# Altium schematic sheet JWB-001_Charger.SchDoc: Charger Design
size B; CompanyName: Rigado, LLC; Organization: Rigado; SheetNumber: 1; Website: www.rigado.com; SheetSize: B
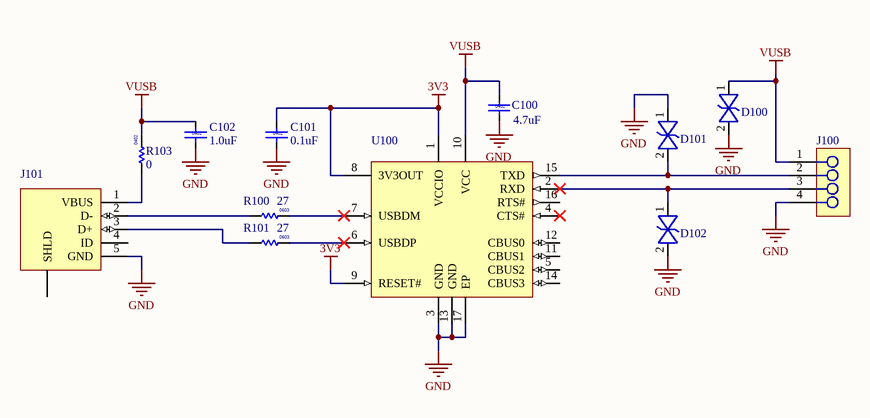
[diagram p0: JWB-001_Charger.SchDoc]

## Parts
(Parts that share a designator on the sheet are numbered #1, #2 ... from top to bottom, then left to right.)
?#1  (no value)  (graphical)
?#2  (no value)  (graphical)
C100  value 4.7uF  Size: 0402  [Cap 0402 HD]  (hidden comment: Cap 0402 4.7uF 10V4.7uF)
C101  value 0.1uF  Size: 0402  [Cap 0402 HD]  (hidden comment: Cap 0402 0.1uF 10V0.1uF)
C102  value 1.0uF  Size: 0402  [Cap 0402 HD]  (hidden comment: Cap 0402 1.0uF 10V1.0uF)
D100  SESD0402P1BN-0450-0906V  [CAP 0402 HD]  (value not drawn)
D101  SESD0402P1BN-0450-0906V  [CAP 0402 HD]  (value not drawn)
D102  SESD0402P1BN-0450-0906V  [CAP 0402 HD]  (value not drawn)
J100  854-22-004-30-001101  [HDR.050P-4Pin-SMT-R]  (value not drawn)
J101  USB_Micro_B_W-Tabs  [USB_Micro_RA_W-TABS]  (value not drawn)
R100  value 27  Size: 0603  [RES 0603 HD]  (hidden comment: Res 0603 27R 5%27)
R101  value 27  Size: 0603  [RES 0603 HD]  (hidden comment: Res 0603 27R 5%27)
R103  value 0  Size: 0402  [RES 0402]  (hidden comment: Res 0402 0R Jumper0)
U100  FT230XQ  [QFN0.65P4x4-16Pin_W-Pad]  (value not drawn)

## Nets
3V3: C101.1 U100.1(VCCIO) U100.8(3V3OUT) U100.9(RESET#)
GND: C100.2 C101.2 C102.2 D100.2 D101.1 D102.2 J100.4 J101.5(GND) U100.3(GND) U100.13(GND) U100.17(EP)
VUSB: C100.1 C102.1 D100.1 J100.1 R103.2 U100.10(VCC)
NetD101_2: D101.2 J100.2 U100.15(TXD)
NetD102_1: D102.1 J100.3 U100.2(RXD)
NetJ101_1: J101.1(VBUS) R103.1
NetJ101_2: J101.2(D-) R100.1
NetJ101_3: J101.3(D+) R101.1
NetR100_2: R100.2 U100.7(USBDM)
NetR101_2: R101.2 U100.6(USBDP)

Not connected (* = marked no-connect by the designer): J101 4(ID) 6(SHLD); U100 4(CTS#)* 5(CBUS2) 11(CBUS1) 12(CBUS0) 14(CBUS3) 16(RTS#)

## Notes on the sheet
- Rev.
- Description
- Revision
- Date
- By
- Prepared By
- Revision:
- Page:

## Library data of the parts
?#1 = Top_Revision_Block: Release Revision History Block
?#2 = Top_Title_Block: Top level schematic title block for top level sheet
C100 = Cap 0402 4.7uF 10V: Cap, Ceramic 4.7uF 10V 20% X5R 0402; Manufacturer P/N: CL05A475MP5NRNC; Manufacturer: Samsung; Manufacturer 2 P/N: C1005X5R1A475M050BC; Vendor: Digikey; Vendor P/N: 1276-1482-1-ND; Added By: Jeremy D; Part Number: Cap 0402 4.7uF 10V; Tolerance: 20%; Voltage: 10V; Manufacturer 2: TDK; Temp Coefficient: X5R; Height: 0.55m; Added Date: 2/1/2015; Checked By: Paul B; Checked Date: 2/5/2015
C101 = Cap 0402 0.1uF 10V: Cap, Ceramic 0.1uF 10V 10% X5R 0402; Manufacturer P/N: GRM155R61A104KA01J; Manufacturer: Murata; Manufacturer 2 P/N: CC0402KRX5R6BB104; Added By: Jeremy D; Part Number: Cap 0402 0.1uF 10V; Tolerance: 10%; Voltage: 10V; Manufacturer 2: Yageo; Temp Coefficient: X5R; Height: 0.6mm; Supplier 1: Digi-key; Supplier Part Number 1: 490-6297-1-ND; Added Date: 4/7/2015; Checked By: Joe K; Checked Date: 4/10/2015
C102 = Cap 0402 1.0uF 10V: Cap, Ceramic 1.0uF 10V 10% X5R 0402; Manufacturer P/N: GRM155R61A105KE15D; Manufacturer: Murata; Manufacturer 2 P/N: C1005X5R0J105K050BB; Added By: Jeremy D; Part Number: Cap 0402 1.0uF 10V; Tolerance: 10%; Voltage: 10V; Manufacturer 2: TDK; Temp Coefficient: X5R; Height: 0.55mm; Supplier 1: Digi-key; Supplier Part Number 1: 490-3890-1-ND; Added Date: 2/1/2015; Checked By: Paul B; Checked Date: 2/5/2015
D100-D102 = SESD0402P1BN-0450-090: ESD TVS Diode, 16kV air, 0402; Manufacturer: TE Connectivity; Voltage Rated: 6V; Vendor: Digikey; Vendor P/N: SESD0402P1BN-0450-090CT-ND; Added By: Jeremy D; Part Number: SESD0402P1BN-0450-090; Manufacturer P/N: SESD0402P1BN-0450-090; Size: 1.1mm x 0.5mm; Package: 0402; Height: 0.6mm; Type: TVS; Added Date: 2/1/2015; Checked By: Paul B; Checked Date: 2/5/2015
J100 = 854-22-004-30-001101: Spring Loaded Header 0.05" Pitch, 4Pin, 4x1, 4.98mm - 6.4mm Height; Manufacturer: Mill-Max; Contacts: 4; Rows: 1; Locking: No; Vendor: Mouser; Vendor P/N: 575-854-22-004-30; Added By: Jeremy D; Part Number: 854-22-004-30-001101; Manufacturer P/N: 854-22-004-30-001101; Size: 5.47mm x 2.21mm; Height: 6.4mm; Pin Pitch: 0.05"; Keyed: No; Added Date: 2/23/2015; Checked By: Cam N; Checked Date: 2/27/2015
J101 = USB_Micro_B_W-Tabs: USB Micro B Receptacle, Right Angle, SMT with 4 TH Tabs; Manufacturer: FCI; Manufacturer P/N: 10118194-0001LF; Manufacturer 2 P/N: ZX62D-B-5P8; Contacts: 6; Rows: 1; Pin Pitch: 0.65mm; Locking: No; Keyed: Yes; Vendor: Digikey; Vendor P/N: 609-4618-1-ND; Added By: Jeremy D; Part Number: USB_Micro_B_W-Tabs; Manufacturer 2: Hirose; Size: 8mm x 5mm; Height: 2.8mm; Added Date: 3/5/2015
R100 R101 = Res 0603 27R 5%: Resistor 27 ohm 5%, 1/10W, 0603; Manufacturer P/N: MCR03ERTJ270; Manufacturer: Rohm; Manufacturer 2 P/N: RC1608J270CS; Vendor: Digikey; Vendor P/N: RHM27CGCT-ND; Added By: Jeremy D; Part Number: Res 0603 27R 5%; Manufacturer 2: Samsung; Tolerance: 5%; Height: .55mm; Power: 1/10W; Added Date: 3/5/2015
R103 = Res 0402 0R Jumper: Resistor 0 ohm 1/16W 0402; Manufacturer P/N: RC1005J000CS; Manufacturer: Samsung; Manufacturer 2 P/N: MCR01MRTJ000; Added By: Jeremy D; Part Number: Res 0402 0R Jumper; Manufacturer 2: Rohm; Height: 0.4mm; Power: 1/16W; Supplier 1: Digi-key; Supplier Part Number 1: 1276-3480-1-ND; Added Date: 4/12/2015
U100 = FT230XQ: USB to UART converter IC, Single channel with flow control, QFN-16; Manufacturer: FTDI; Manufacturer P/N: FT230XQ-R; Voltage-Rated: 5.5V; Vendor: Digikey; Vendor P/N: 768-1130-1-ND; 1k Price: 1.46; Added By: Jeremy D; Part Number: FT230XQ; MFG Footprint: QFN-16; Height: .8mm; Size: 4.1mm x 4.1mm; Packaging: Tape & Reel; Features: USB to UART with flow control; Controller Interface: UART; Added Date: 3/5/2015